# Altium schematic sheet FPGA_RAM.SchDoc: BaseBand Front-End
size A2; Revision: 1; SheetNumber: 2
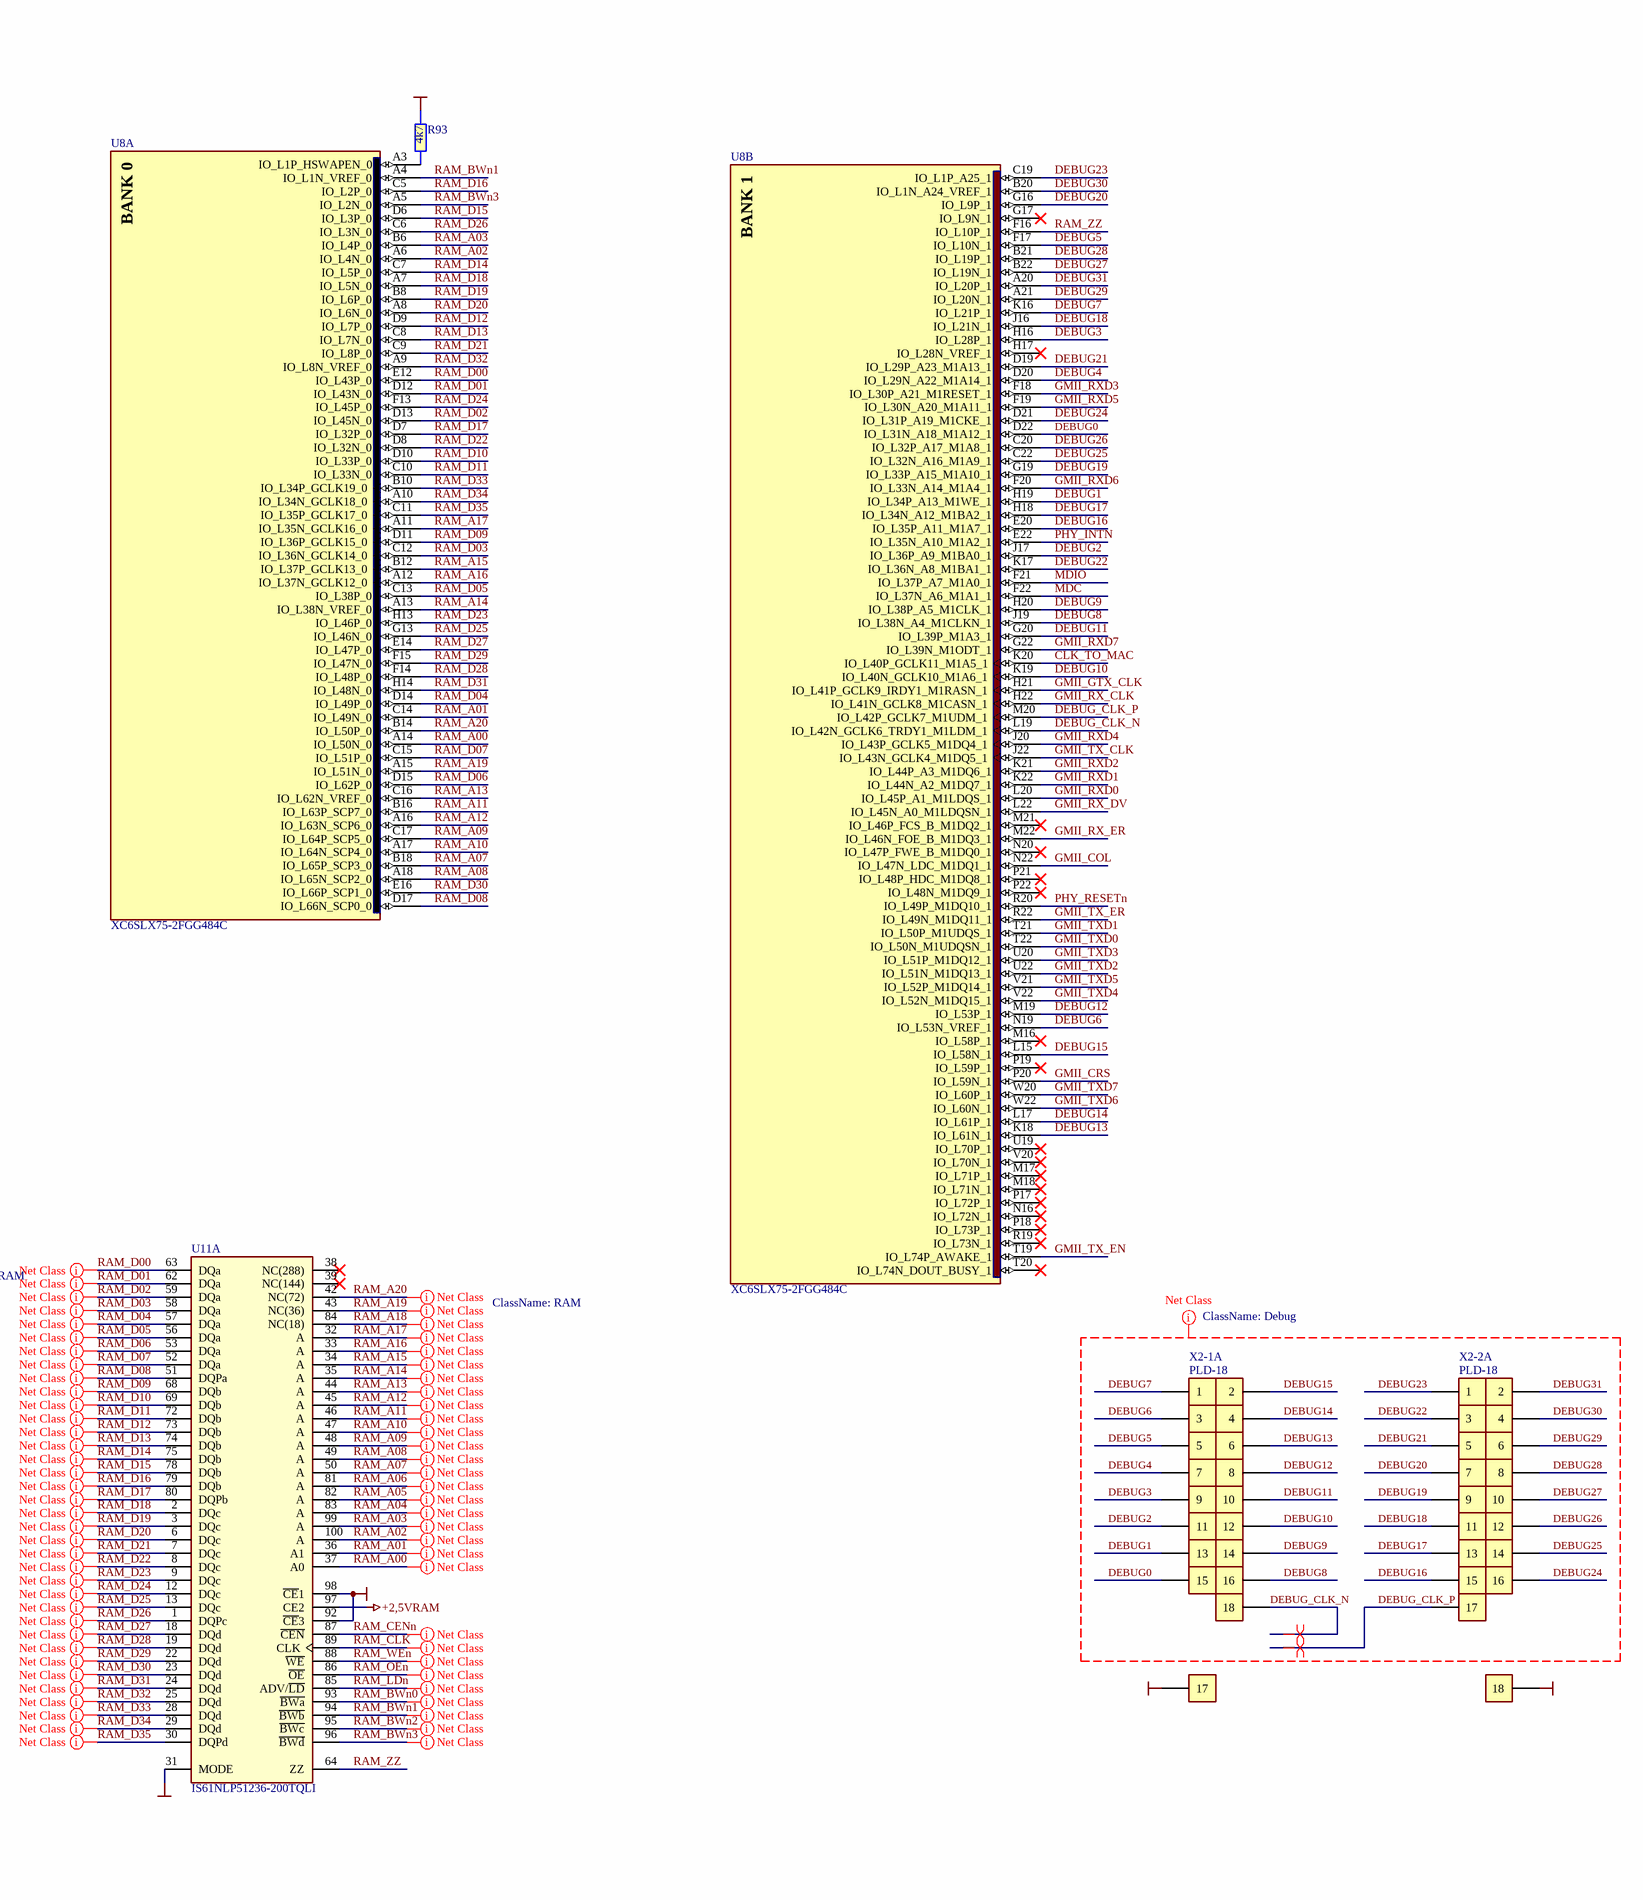
[diagram p0: FPGA_RAM.SchDoc, left]
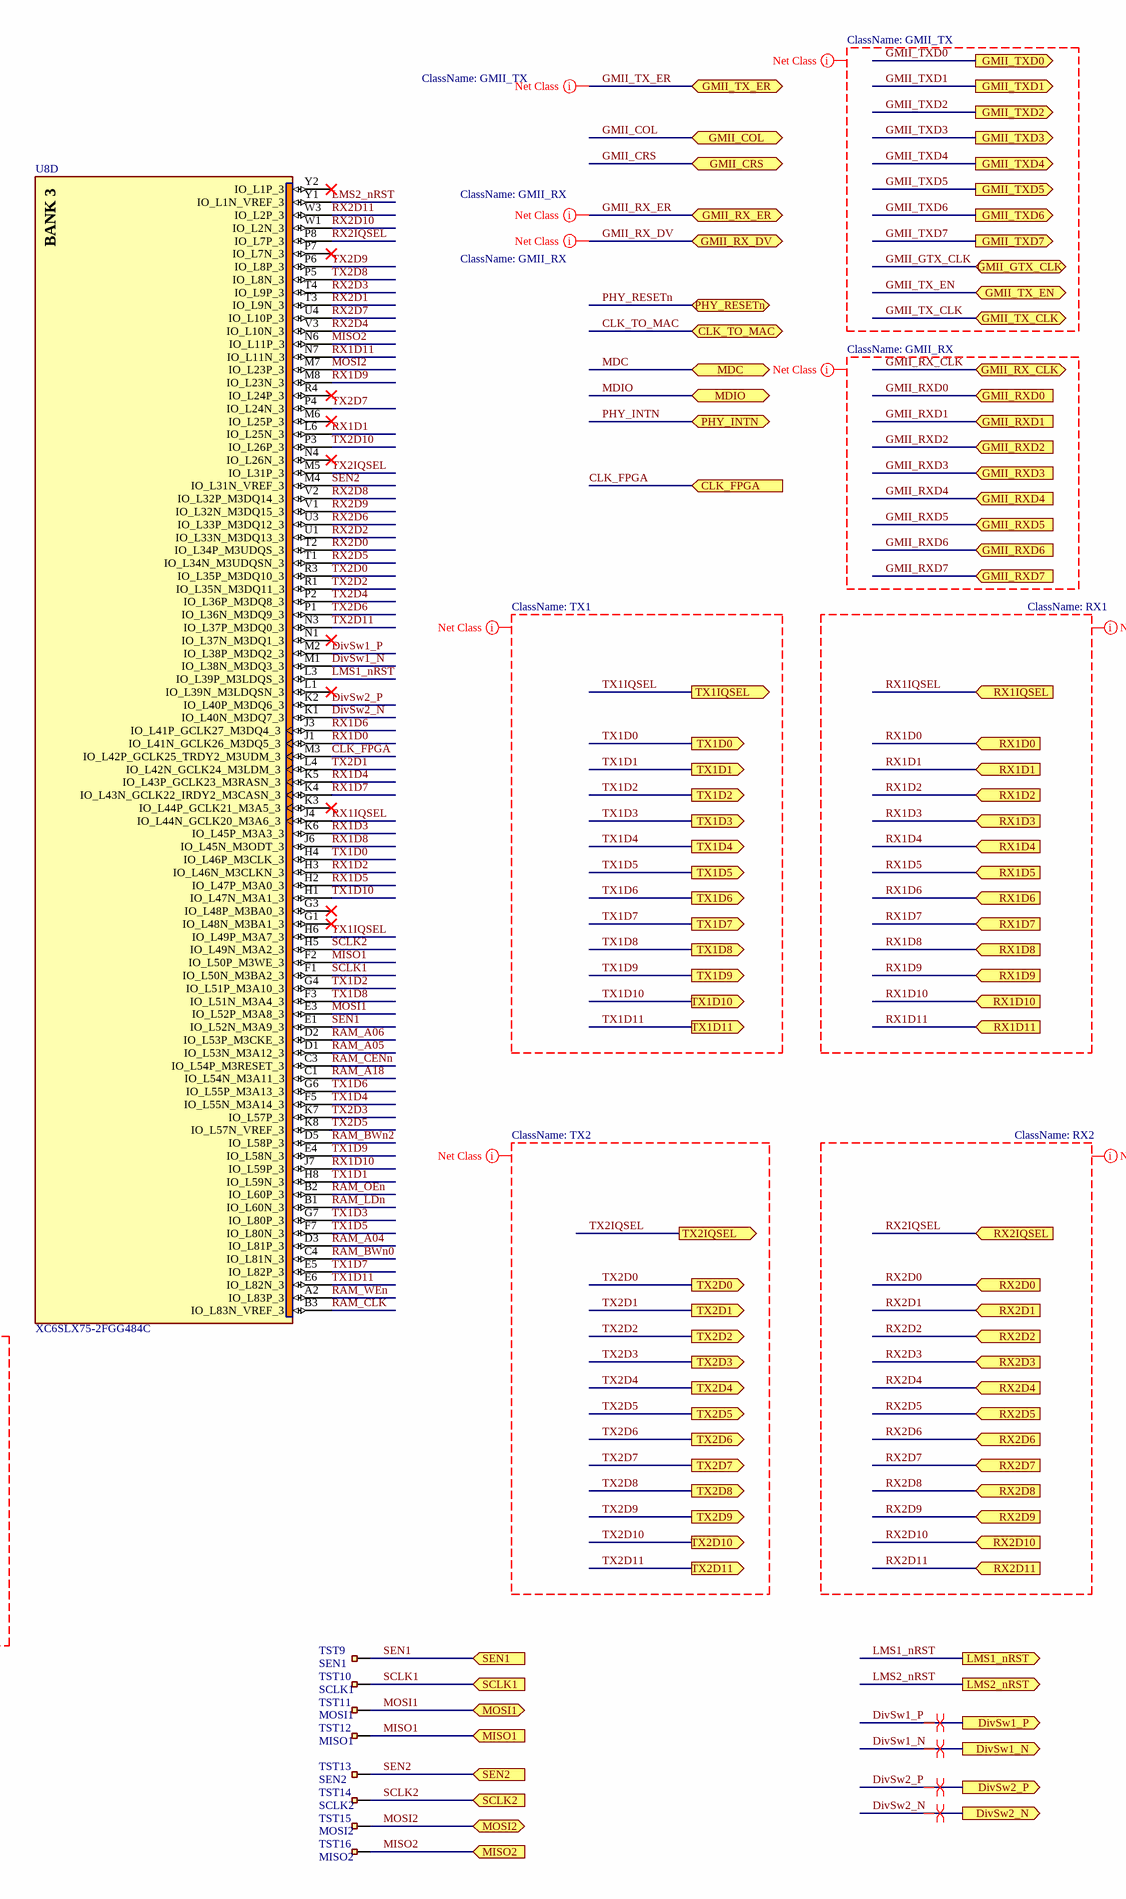
[diagram p1: FPGA_RAM.SchDoc, right]

## Parts
R93  4k7  [R0603-PHILLIPS]
TST9  SEN1  [kp40x40]
TST10  SCLK1  [kp40x40]
TST11  MOSI1  [kp40x40]
TST12  MISO1  [kp40x40]
TST13  SEN2  [kp40x40]
TST14  SCLK2  [kp40x40]
TST15  MOSI2  [kp40x40]
TST16  MISO2  [kp40x40]
U8  XC6SLX75-2FGG484C  [FBGA484]  (parts A,B,D of 8)
U11  IS61NLP51236-200TQLI  [QFP-10020X14/0.65]]  (part A of 2)
X2-1  PLD-18  [PLD-18]  (parts A,B,C,D,E,F,G,H,I,J,K,L,M,N,O,P,Q,R of 18)
X2-2  PLD-18  [PLD-18]  (parts A,B,C,D,E,F,G,H,I,J,K,L,M,N,O,P,Q,R of 18)

## Ports
CLK_FPGA (in), CLK_TO_MAC, DivSw1_N (out), DivSw1_P (out), DivSw2_N (out), DivSw2_P (out), GMII_COL, GMII_CRS, GMII_GTX_CLK, GMII_RX_CLK, GMII_RX_DV, GMII_RX_ER, GMII_RXD0 (in), GMII_RXD1 (in), GMII_RXD2 (in), GMII_RXD3 (in), GMII_RXD4 (in), GMII_RXD5 (in), GMII_RXD6 (in), GMII_RXD7 (in), GMII_TX_CLK, GMII_TX_EN, GMII_TX_ER, GMII_TXD0 (out), GMII_TXD1 (out), GMII_TXD2 (out), GMII_TXD3 (out), GMII_TXD4 (out), GMII_TXD5 (out), GMII_TXD6 (out), GMII_TXD7 (out), LMS1_nRST (out), LMS2_nRST (out), MDC, MDIO, MISO1 (in), MISO2 (in), MOSI1 (bidir), MOSI2 (bidir), PHY_INTN, PHY_RESETn, RX1D0 (in), RX1D1 (in), RX1D2 (in), RX1D3 (in), RX1D4 (in), RX1D5 (in), RX1D6 (in), RX1D7 (in), RX1D8 (in), RX1D9 (in), RX1D10 (in), RX1D11 (in), RX1IQSEL (in), RX2D0 (in), RX2D1 (in), RX2D2 (in), RX2D3 (in), RX2D4 (in), RX2D5 (in), RX2D6 (in), RX2D7 (in), RX2D8 (in), RX2D9 (in), RX2D10 (in), RX2D11 (in), RX2IQSEL (in), SCLK1 (in), SCLK2 (in), SEN1 (in), SEN2 (in), TX1D0 (out), TX1D1 (out), TX1D2 (out), TX1D3 (out), TX1D4 (out), TX1D5 (out), TX1D6 (out), TX1D7 (out), TX1D8 (out), TX1D9 (out), TX1D10 (out), TX1D11 (out), TX1IQSEL (out), TX2D0 (out), TX2D1 (out), TX2D2 (out), TX2D3 (out), TX2D4 (out), TX2D5 (out), TX2D6 (out), TX2D7 (out), TX2D8 (out), TX2D9 (out), TX2D10 (out), TX2D11 (out), TX2IQSEL (out)

## Nets
+2,5VRAM: U11.97(CE2)
GND: R93.2 U11.31(MODE) U11.92(~{CE}3) U11.98(~{CE}1) X2-1.17 X2-2.18
CLK_FPGA: U8.M3(IO_L42P_GCLK25_TRDY2_M3UDM_3) ; port CLK_FPGA
CLK_TO_MAC: U8.K20(IO_L40P_GCLK11_M1A5_1) ; port CLK_TO_MAC
DEBUG0: U8.D22(IO_L31N_A18_M1A12_1) X2-1.15
DEBUG1: U8.H19(IO_L34P_A13_M1WE_1) X2-1.13
DEBUG2: U8.J17(IO_L36P_A9_M1BA0_1) X2-1.11
DEBUG3: U8.H16(IO_L28P_1) X2-1.9
DEBUG4: U8.D20(IO_L29N_A22_M1A14_1) X2-1.7
DEBUG5: U8.F17(IO_L10N_1) X2-1.5
DEBUG6: U8.N19(IO_L53N_VREF_1) X2-1.3
DEBUG7: U8.K16(IO_L21P_1) X2-1.1
DEBUG8: U8.J19(IO_L38N_A4_M1CLKN_1) X2-1.16
DEBUG9: U8.H20(IO_L38P_A5_M1CLK_1) X2-1.14
DEBUG10: U8.K19(IO_L40N_GCLK10_M1A6_1) X2-1.12
DEBUG11: U8.G20(IO_L39P_M1A3_1) X2-1.10
DEBUG12: U8.M19(IO_L53P_1) X2-1.8
DEBUG13: U8.K18(IO_L61N_1) X2-1.6
DEBUG14: U8.L17(IO_L61P_1) X2-1.4
DEBUG15: U8.L15(IO_L58N_1) X2-1.2
DEBUG16: U8.E20(IO_L35P_A11_M1A7_1) X2-2.15
DEBUG17: U8.H18(IO_L34N_A12_M1BA2_1) X2-2.13
DEBUG18: U8.J16(IO_L21N_1) X2-2.11
DEBUG19: U8.G19(IO_L33P_A15_M1A10_1) X2-2.9
DEBUG20: U8.G16(IO_L9P_1) X2-2.7
DEBUG21: U8.D19(IO_L29P_A23_M1A13_1) X2-2.5
DEBUG22: U8.K17(IO_L36N_A8_M1BA1_1) X2-2.3
DEBUG23: U8.C19(IO_L1P_A25_1) X2-2.1
DEBUG24: U8.D21(IO_L31P_A19_M1CKE_1) X2-2.16
DEBUG25: U8.C22(IO_L32N_A16_M1A9_1) X2-2.14
DEBUG26: U8.C20(IO_L32P_A17_M1A8_1) X2-2.12
DEBUG27: U8.B22(IO_L19N_1) X2-2.10
DEBUG28: U8.B21(IO_L19P_1) X2-2.8
DEBUG29: U8.A21(IO_L20N_1) X2-2.6
DEBUG30: U8.B20(IO_L1N_A24_VREF_1) X2-2.4
DEBUG31: U8.A20(IO_L20P_1) X2-2.2
DEBUG_CLK_N: U8.L19(IO_L42N_GCLK6_TRDY1_M1LDM_1) X2-1.18
DEBUG_CLK_P: U8.M20(IO_L42P_GCLK7_M1UDM_1) X2-2.17
DivSw1_N: U8.M1(IO_L38N_M3DQ3_3) ; port DivSw1_N
DivSw1_P: U8.M2(IO_L38P_M3DQ2_3) ; port DivSw1_P
DivSw2_N: U8.K1(IO_L40N_M3DQ7_3) ; port DivSw2_N
DivSw2_P: U8.K2(IO_L40P_M3DQ6_3) ; port DivSw2_P
GMII_COL: U8.N22(IO_L47N_LDC_M1DQ1_1) ; port GMII_COL
GMII_CRS: U8.P20(IO_L59N_1) ; port GMII_CRS
GMII_GTX_CLK: U8.H21(IO_L41P_GCLK9_IRDY1_M1RASN_1) ; port GMII_GTX_CLK
GMII_RX_CLK: U8.H22(IO_L41N_GCLK8_M1CASN_1) ; port GMII_RX_CLK
GMII_RX_DV: U8.L22(IO_L45N_A0_M1LDQSN_1) ; port GMII_RX_DV
GMII_RX_ER: U8.M22(IO_L46N_FOE_B_M1DQ3_1) ; port GMII_RX_ER
GMII_RXD0: U8.L20(IO_L45P_A1_M1LDQS_1) ; port GMII_RXD0
GMII_RXD1: U8.K22(IO_L44N_A2_M1DQ7_1) ; port GMII_RXD1
GMII_RXD2: U8.K21(IO_L44P_A3_M1DQ6_1) ; port GMII_RXD2
GMII_RXD3: U8.F18(IO_L30P_A21_M1RESET_1) ; port GMII_RXD3
GMII_RXD4: U8.J20(IO_L43P_GCLK5_M1DQ4_1) ; port GMII_RXD4
GMII_RXD5: U8.F19(IO_L30N_A20_M1A11_1) ; port GMII_RXD5
GMII_RXD6: U8.F20(IO_L33N_A14_M1A4_1) ; port GMII_RXD6
GMII_RXD7: U8.G22(IO_L39N_M1ODT_1) ; port GMII_RXD7
GMII_TX_CLK: U8.J22(IO_L43N_GCLK4_M1DQ5_1) ; port GMII_TX_CLK
GMII_TX_EN: U8.T19(IO_L74P_AWAKE_1) ; port GMII_TX_EN
GMII_TX_ER: U8.R22(IO_L49N_M1DQ11_1) ; port GMII_TX_ER
GMII_TXD0: U8.T22(IO_L50N_M1UDQSN_1) ; port GMII_TXD0
GMII_TXD1: U8.T21(IO_L50P_M1UDQS_1) ; port GMII_TXD1
GMII_TXD2: U8.U22(IO_L51N_M1DQ13_1) ; port GMII_TXD2
GMII_TXD3: U8.U20(IO_L51P_M1DQ12_1) ; port GMII_TXD3
GMII_TXD4: U8.V22(IO_L52N_M1DQ15_1) ; port GMII_TXD4
GMII_TXD5: U8.V21(IO_L52P_M1DQ14_1) ; port GMII_TXD5
GMII_TXD6: U8.W22(IO_L60N_1) ; port GMII_TXD6
GMII_TXD7: U8.W20(IO_L60P_1) ; port GMII_TXD7
LMS1_nRST: U8.L3(IO_L39P_M3LDQS_3) ; port LMS1_nRST
LMS2_nRST: U8.Y1(IO_L1N_VREF_3) ; port LMS2_nRST
MDC: U8.F22(IO_L37N_A6_M1A1_1) ; port MDC
MDIO: U8.F21(IO_L37P_A7_M1A0_1) ; port MDIO
MISO1: TST12.1 U8.F2(IO_L50P_M3WE_3) ; port MISO1
MISO2: TST16.1 U8.N6(IO_L11P_3) ; port MISO2
MOSI1: TST11.1 U8.E3(IO_L52P_M3A8_3) ; port MOSI1
MOSI2: TST15.1 U8.M7(IO_L23P_3) ; port MOSI2
PHY_INTN: U8.E22(IO_L35N_A10_M1A2_1) ; port PHY_INTN
PHY_RESETn: U8.R20(IO_L49P_M1DQ10_1) ; port PHY_RESETn
RAM_A00: U8.A14(IO_L50N_0) U11.37(A0)
RAM_A01: U8.C14(IO_L49N_0) U11.36(A1)
RAM_A02: U8.A6(IO_L4N_0) U11.100(A)
RAM_A03: U8.B6(IO_L4P_0) U11.99(A)
RAM_A04: U8.D3(IO_L81P_3) U11.83(A)
RAM_A05: U8.D1(IO_L53N_M3A12_3) U11.82(A)
RAM_A06: U8.D2(IO_L53P_M3CKE_3) U11.81(A)
RAM_A07: U8.B18(IO_L65P_SCP3_0) U11.50(A)
RAM_A08: U8.A18(IO_L65N_SCP2_0) U11.49(A)
RAM_A09: U8.C17(IO_L64P_SCP5_0) U11.48(A)
RAM_A10: U8.A17(IO_L64N_SCP4_0) U11.47(A)
RAM_A11: U8.B16(IO_L63P_SCP7_0) U11.46(A)
RAM_A12: U8.A16(IO_L63N_SCP6_0) U11.45(A)
RAM_A13: U8.C16(IO_L62N_VREF_0) U11.44(A)
RAM_A14: U8.A13(IO_L38N_VREF_0) U11.35(A)
RAM_A15: U8.B12(IO_L37P_GCLK13_0) U11.34(A)
RAM_A16: U8.A12(IO_L37N_GCLK12_0) U11.33(A)
RAM_A17: U8.A11(IO_L35N_GCLK16_0) U11.32(A)
RAM_A18: U8.C1(IO_L54N_M3A11_3) U11.84(NC(18))
RAM_A19: U8.A15(IO_L51N_0) U11.43(NC(36))
RAM_A20: U8.B14(IO_L50P_0) U11.42(NC(72))
RAM_BWn0: U8.C4(IO_L81N_3) U11.93(~{BWa})
RAM_BWn1: U8.A4(IO_L1N_VREF_0) U11.94(~{BWb})
RAM_BWn2: U8.D5(IO_L58P_3) U11.95(~{BWc})
RAM_BWn3: U8.A5(IO_L2N_0) U11.96(~{BWd})
RAM_CENn: U8.C3(IO_L54P_M3RESET_3) U11.87(~{CEN})
RAM_CLK: U8.B3(IO_L83N_VREF_3) U11.89(CLK)
RAM_D00: U8.E12(IO_L43P_0) U11.63(DQa)
RAM_D01: U8.D12(IO_L43N_0) U11.62(DQa)
RAM_D02: U8.D13(IO_L45N_0) U11.59(DQa)
RAM_D03: U8.C12(IO_L36N_GCLK14_0) U11.58(DQa)
RAM_D04: U8.D14(IO_L49P_0) U11.57(DQa)
RAM_D05: U8.C13(IO_L38P_0) U11.56(DQa)
RAM_D06: U8.D15(IO_L62P_0) U11.53(DQa)
RAM_D07: U8.C15(IO_L51P_0) U11.52(DQa)
RAM_D08: U8.D17(IO_L66N_SCP0_0) U11.51(DQPa)
RAM_D09: U8.D11(IO_L36P_GCLK15_0) U11.68(DQb)
RAM_D10: U8.D10(IO_L33P_0) U11.69(DQb)
RAM_D11: U8.C10(IO_L33N_0) U11.72(DQb)
RAM_D12: U8.D9(IO_L7P_0) U11.73(DQb)
RAM_D13: U8.C8(IO_L7N_0) U11.74(DQb)
RAM_D14: U8.C7(IO_L5P_0) U11.75(DQb)
RAM_D15: U8.D6(IO_L3P_0) U11.78(DQb)
RAM_D16: U8.C5(IO_L2P_0) U11.79(DQb)
RAM_D17: U8.D7(IO_L32P_0) U11.80(DQPb)
RAM_D18: U8.A7(IO_L5N_0) U11.2(DQc)
RAM_D19: U8.B8(IO_L6P_0) U11.3(DQc)
RAM_D20: U8.A8(IO_L6N_0) U11.6(DQc)
RAM_D21: U8.C9(IO_L8P_0) U11.7(DQc)
RAM_D22: U8.D8(IO_L32N_0) U11.8(DQc)
RAM_D23: U8.H13(IO_L46P_0) U11.9(DQc)
RAM_D24: U8.F13(IO_L45P_0) U11.12(DQc)
RAM_D25: U8.G13(IO_L46N_0) U11.13(DQc)
RAM_D26: U8.C6(IO_L3N_0) U11.1(DQPc)
RAM_D27: U8.E14(IO_L47P_0) U11.18(DQd)
RAM_D28: U8.F14(IO_L48P_0) U11.19(DQd)
RAM_D29: U8.F15(IO_L47N_0) U11.22(DQd)
RAM_D30: U8.E16(IO_L66P_SCP1_0) U11.23(DQd)
RAM_D31: U8.H14(IO_L48N_0) U11.24(DQd)
RAM_D32: U8.A9(IO_L8N_VREF_0) U11.25(DQd)
RAM_D33: U8.B10(IO_L34P_GCLK19_0) U11.28(DQd)
RAM_D34: U8.A10(IO_L34N_GCLK18_0) U11.29(DQd)
RAM_D35: U8.C11(IO_L35P_GCLK17_0) U11.30(DQPd)
RAM_LDn: U8.B1(IO_L60N_3) U11.85(ADV/~{LD})
RAM_OEn: U8.B2(IO_L60P_3) U11.86(~{OE})
RAM_WEn: U8.A2(IO_L83P_3) U11.88(~{WE})
RAM_ZZ: U8.F16(IO_L10P_1) U11.64(ZZ)
RX1D0: U8.J1(IO_L41N_GCLK26_M3DQ5_3) ; port RX1D0
RX1D1: U8.L6(IO_L25N_3) ; port RX1D1
RX1D2: U8.H3(IO_L46N_M3CLKN_3) ; port RX1D2
RX1D3: U8.K6(IO_L45P_M3A3_3) ; port RX1D3
RX1D4: U8.K5(IO_L43P_GCLK23_M3RASN_3) ; port RX1D4
RX1D5: U8.H2(IO_L47P_M3A0_3) ; port RX1D5
RX1D6: U8.J3(IO_L41P_GCLK27_M3DQ4_3) ; port RX1D6
RX1D7: U8.K4(IO_L43N_GCLK22_IRDY2_M3CASN_3) ; port RX1D7
RX1D8: U8.J6(IO_L45N_M3ODT_3) ; port RX1D8
RX1D9: U8.M8(IO_L23N_3) ; port RX1D9
RX1D10: U8.J7(IO_L59P_3) ; port RX1D10
RX1D11: U8.N7(IO_L11N_3) ; port RX1D11
RX1IQSEL: U8.J4(IO_L44N_GCLK20_M3A6_3) ; port RX1IQSEL
RX2D0: U8.T2(IO_L34P_M3UDQS_3) ; port RX2D0
RX2D1: U8.T3(IO_L9N_3) ; port RX2D1
RX2D2: U8.U1(IO_L33N_M3DQ13_3) ; port RX2D2
RX2D3: U8.T4(IO_L9P_3) ; port RX2D3
RX2D4: U8.V3(IO_L10N_3) ; port RX2D4
RX2D5: U8.T1(IO_L34N_M3UDQSN_3) ; port RX2D5
RX2D6: U8.U3(IO_L33P_M3DQ12_3) ; port RX2D6
RX2D7: U8.U4(IO_L10P_3) ; port RX2D7
RX2D8: U8.V2(IO_L32P_M3DQ14_3) ; port RX2D8
RX2D9: U8.V1(IO_L32N_M3DQ15_3) ; port RX2D9
RX2D10: U8.W1(IO_L2N_3) ; port RX2D10
RX2D11: U8.W3(IO_L2P_3) ; port RX2D11
RX2IQSEL: U8.P8(IO_L7P_3) ; port RX2IQSEL
SCLK1: TST10.1 U8.F1(IO_L50N_M3BA2_3) ; port SCLK1
SCLK2: TST14.1 U8.H5(IO_L49N_M3A2_3) ; port SCLK2
SEN1: TST9.1 U8.E1(IO_L52N_M3A9_3) ; port SEN1
SEN2: TST13.1 U8.M4(IO_L31N_VREF_3) ; port SEN2
TX1D0: U8.H4(IO_L46P_M3CLK_3) ; port TX1D0
TX1D1: U8.H8(IO_L59N_3) ; port TX1D1
TX1D2: U8.G4(IO_L51P_M3A10_3) ; port TX1D2
TX1D3: U8.G7(IO_L80P_3) ; port TX1D3
TX1D4: U8.F5(IO_L55N_M3A14_3) ; port TX1D4
TX1D5: U8.F7(IO_L80N_3) ; port TX1D5
TX1D6: U8.G6(IO_L55P_M3A13_3) ; port TX1D6
TX1D7: U8.E5(IO_L82P_3) ; port TX1D7
TX1D8: U8.F3(IO_L51N_M3A4_3) ; port TX1D8
TX1D9: U8.E4(IO_L58N_3) ; port TX1D9
TX1D10: U8.H1(IO_L47N_M3A1_3) ; port TX1D10
TX1D11: U8.E6(IO_L82N_3) ; port TX1D11
TX1IQSEL: U8.H6(IO_L49P_M3A7_3) ; port TX1IQSEL
TX2D0: U8.R3(IO_L35P_M3DQ10_3) ; port TX2D0
TX2D1: U8.L4(IO_L42N_GCLK24_M3LDM_3) ; port TX2D1
TX2D2: U8.R1(IO_L35N_M3DQ11_3) ; port TX2D2
TX2D3: U8.K7(IO_L57P_3) ; port TX2D3
TX2D4: U8.P2(IO_L36P_M3DQ8_3) ; port TX2D4
TX2D5: U8.K8(IO_L57N_VREF_3) ; port TX2D5
TX2D6: U8.P1(IO_L36N_M3DQ9_3) ; port TX2D6
TX2D7: U8.P4(IO_L24N_3) ; port TX2D7
TX2D8: U8.P5(IO_L8N_3) ; port TX2D8
TX2D9: U8.P6(IO_L8P_3) ; port TX2D9
TX2D10: U8.P3(IO_L26P_3) ; port TX2D10
TX2D11: U8.N3(IO_L37P_M3DQ0_3) ; port TX2D11
TX2IQSEL: U8.M5(IO_L31P_3) ; port TX2IQSEL
NetR93_1: R93.1 U8.A3(IO_L1P_HSWAPEN_0)

Not connected (* = marked no-connect by the designer): U8 G1(IO_L48N_M3BA1_3)* G3(IO_L48P_M3BA0_3)* G17(IO_L9N_1)* H17(IO_L28N_VREF_1)* K3(IO_L44P_GCLK21_M3A5_3)* L1(IO_L39N_M3LDQSN_3)* M6(IO_L25P_3)* M16(IO_L58P_1)* M17(IO_L71P_1)* M18(IO_L71N_1)* M21(IO_L46P_FCS_B_M1DQ2_1)* N1(IO_L37N_M3DQ1_3)* N4(IO_L26N_3)* N16(IO_L72N_1)* N20(IO_L47P_FWE_B_M1DQ0_1)* P7(IO_L7N_3)* P17(IO_L72P_1)* P18(IO_L73P_1)* P19(IO_L59P_1)* P21(IO_L48P_HDC_M1DQ8_1)* P22(IO_L48N_M1DQ9_1)* R4(IO_L24P_3)* R19(IO_L73N_1)* T20(IO_L74N_DOUT_BUSY_1)* U19(IO_L70P_1)* V20(IO_L70N_1)* Y2(IO_L1P_3)*; U11 38(NC(288))* 39(NC(144))*

## Layout directives
net class RX1: RX1D0, RX1D1, RX1D2, RX1D3, RX1D4, RX1D5, RX1D6, RX1D7, RX1D8, RX1D9, RX1D10, RX1D11, RX1IQSEL
net class RX2: RX2D0, RX2D1, RX2D2, RX2D3, RX2D4, RX2D5, RX2D6, RX2D7, RX2D8, RX2D9, RX2D10, RX2D11, RX2IQSEL
net class TX1: TX1D0, TX1D1, TX1D2, TX1D3, TX1D4, TX1D5, TX1D6, TX1D7, TX1D8, TX1D9, TX1D10, TX1D11, TX1IQSEL
net class TX2: TX2D0, TX2D1, TX2D2, TX2D3, TX2D4, TX2D5, TX2D6, TX2D7, TX2D8, TX2D9, TX2D10, TX2D11, TX2IQSEL
net class GMII_TX: GMII_GTX_CLK, GMII_TX_CLK, GMII_TX_EN, GMII_TX_ER, GMII_TXD0, GMII_TXD1, GMII_TXD2, GMII_TXD3, GMII_TXD4, GMII_TXD5, GMII_TXD6, GMII_TXD7
net class RAM: RAM_A00, RAM_A01, RAM_A02, RAM_A03, RAM_A04, RAM_A05, RAM_A06, RAM_A07, RAM_A08, RAM_A09, RAM_A10, RAM_A11, RAM_A12, RAM_A13, RAM_A14, RAM_A15, RAM_A16, RAM_A17, RAM_A18, RAM_A19, RAM_A20, RAM_BWn0, RAM_BWn1, RAM_BWn2, RAM_BWn3, RAM_CENn, RAM_CLK, RAM_D00, RAM_D01, RAM_D02, RAM_D03, RAM_D04, RAM_D05, RAM_D06, RAM_D07, RAM_D08, RAM_D09, RAM_D10, RAM_D11, RAM_D12, RAM_D13, RAM_D14, RAM_D15, RAM_D16, RAM_D17, RAM_D18, RAM_D19, RAM_D20, RAM_D21, RAM_D22, RAM_D23, RAM_D24, RAM_D25, RAM_D26, RAM_D27, RAM_D28, RAM_D29, RAM_D30, RAM_D31, RAM_D32, RAM_D33, RAM_D34, RAM_D35, RAM_LDn, RAM_OEn, RAM_WEn
differential pair: DEBUG_CLK_N, DEBUG_CLK_P, DivSw1_N, DivSw1_P, DivSw2_N, DivSw2_P
net class GMII_RX: GMII_RX_CLK, GMII_RX_DV, GMII_RX_ER, GMII_RXD0, GMII_RXD1, GMII_RXD2, GMII_RXD3, GMII_RXD4, GMII_RXD5, GMII_RXD6, GMII_RXD7
net class Debug: DEBUG0, DEBUG1, DEBUG2, DEBUG3, DEBUG4, DEBUG5, DEBUG6, DEBUG7, DEBUG8, DEBUG9, DEBUG10, DEBUG11, DEBUG12, DEBUG13, DEBUG14, DEBUG15, DEBUG16, DEBUG17, DEBUG18, DEBUG19, DEBUG20, DEBUG21, DEBUG22, DEBUG23, DEBUG24, DEBUG25, DEBUG26, DEBUG27, DEBUG28, DEBUG29, DEBUG30, DEBUG31, DEBUG_CLK_N, DEBUG_CLK_P

## Notes on the sheet
- (in symbol XC6SLX75-2FGG484C, part A) BANK 0
- (in symbol XC6SLX75-2FGG484C, part B) BANK 1
- (in symbol XC6SLX75-2FGG484C, part D) BANK 3

## Library data of the parts
R93 = R0603: Резистор; Manufacturer: YAGEO; Tolerance: 5%; Name: SMD0603; U/P/TKE: 0.1W; Value: 4k7
TST9-TST16 = KP: Контактная площадка; Manufacturer: Конструктив
  TST9: Name: SEN1
  TST10: Name: SCLK1
  TST11: Name: MOSI1
  TST12: Name: MISO1
  TST13: Name: SEN2
  TST14: Name: SCLK2
  TST15: Name: MOSI2
  TST16: Name: MISO2
U8 = XC6SLX75-2FGG484C: Spartan-6 LX 1.2V FPGA, 270 User I/Os, 484-Ball Fine-Pitch BGA (1.0mm Pitch), Speed Grade 2, Commercial Grade, Pb-Free; Manufacturer: Xilinx; Published: 1-Jul-2010; Supplier 1: Digi-Key; Supplier Part Number 1: XC6SLX75-2FGG484C-ND; ComponentLink1Description: Manufacturer Link; ComponentLink1URL: http://www.xilinx.com; ComponentLink2Description: Spartan-6 Datasheet; ComponentLink2URL: http://www.xilinx.com/support/documentation/data_sheets/ds160.pdf; ComponentLink3Description: Spartan-6 Documents; ComponentLink3URL: http://www.xilinx.com/support/documentation/spartan-6.htm; ComponentLink4Description: Xilinx.com Home; ComponentLink4URL: http://www.xilinx.com; Misc: Spartan-6 LX 1.2V FPGA; Name: XC6SLX75-2FGG484C
U11 = CY7C1354C-166AXI: Микросхема; Manufacturer: ISSI; Misc: Pipelined SRAM with NoBL™ Architecture; Name: IS61NLP51236-200TQLI
X2-1 X2-2 = PLD-18: Разъем; Manufacturer: BM; Name: PLD-18